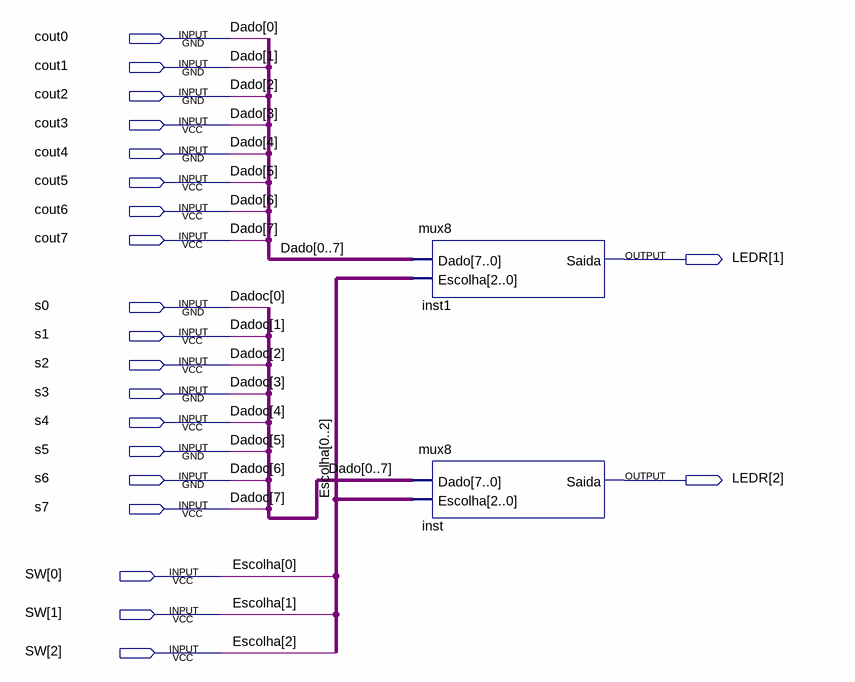
[diagram p0: schematic sheet]
// Quartus schematic Exp6_main.bdf as structural Verilog: 2 symbols, 21 pins
module Exp6_main (
  input  cout0,
  input  cout1,
  input  cout2,
  input  cout3,
  input  cout4,
  input  cout5,
  input  cout6,
  input  cout7,
  input  s0,
  input  s1,
  input  s2,
  input  s3,
  input  s4,
  input  s5,
  input  s6,
  input  s7,
  input  [2:0] SW,
  output [2:1] LEDR
);

  mux8 inst1 (
    .Dado({cout0, cout1, cout2, cout3, cout4, cout5, cout6, cout7}), .Escolha({SW[0], SW[1], SW[2]}),
    .Saida(LEDR[1]));
  mux8 inst (
    .Dado({cout0, cout1, cout2, cout3, cout4, cout5, cout6, cout7}), .Escolha({SW[0], SW[1], SW[2]}),
    .Saida(LEDR[2]));

  // Other names for the same wires on the sheet: Dado[7:0] = {cout7, cout6, cout5, cout4, cout3, cout2, cout1, cout0};
  //   Dadoc[7:0] = {s7, s6, s5, s4, s3, s2, s1, s0}; Escolha[2:0] = SW
endmodule
